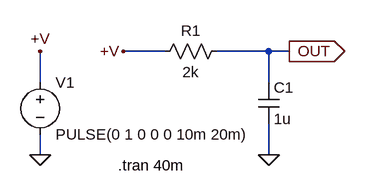
[diagram p0: schematic Circuit4_01.asc]
Circuit4_01.asc, the LTspice schematic file:
Version 4
SHEET 1 880 680
WIRE 304 192 240 192
WIRE 464 192 384 192
WIRE 496 192 464 192
WIRE 112 240 112 192
WIRE 464 240 464 192
WIRE 112 352 112 320
WIRE 464 352 464 304
FLAG 112 352 0
FLAG 112 192 +V
FLAG 240 192 +V
FLAG 496 192 OUT
IOPIN 496 192 Out
FLAG 464 352 0
SYMBOL voltage 112 224 R0
SYMATTR InstName V1
SYMATTR Value PULSE(0 1 0 0 0 10m 20m)
SYMBOL res 400 176 R90
WINDOW 0 0 56 VBottom 2
WINDOW 3 32 56 VTop 2
SYMATTR InstName R1
SYMATTR Value 2k
SYMBOL cap 448 240 R0
SYMATTR InstName C1
SYMATTR Value 1u
TEXT 232 368 Left 2 !.tran 40m

The netlist it stands for:
* Circuit4_01.asc
V1 +V 0 PULSE(0 1 0 0 0 10m 20m)
R1 OUT +V 2k
C1 OUT 0 1u
.tran 40m
.backanno
.end

* Results of the author's LTspice run, read from the files saved beside the schematic
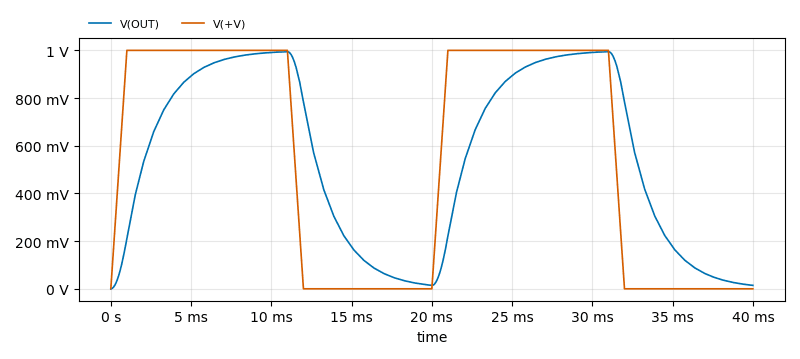
[diagram p1: Transient Analysis of Circuit4_01.asc, plotted from the saved traces]
* Transient Analysis, 1 run:
*   V(OUT): min 0 V, max 994.8 mV, average 549.3 mV, rms 670.6 mV, last 14.35 mV
*   V(+V): min 0 V, max 1 V, average 550 mV, rms 730.5 mV, last 0 V